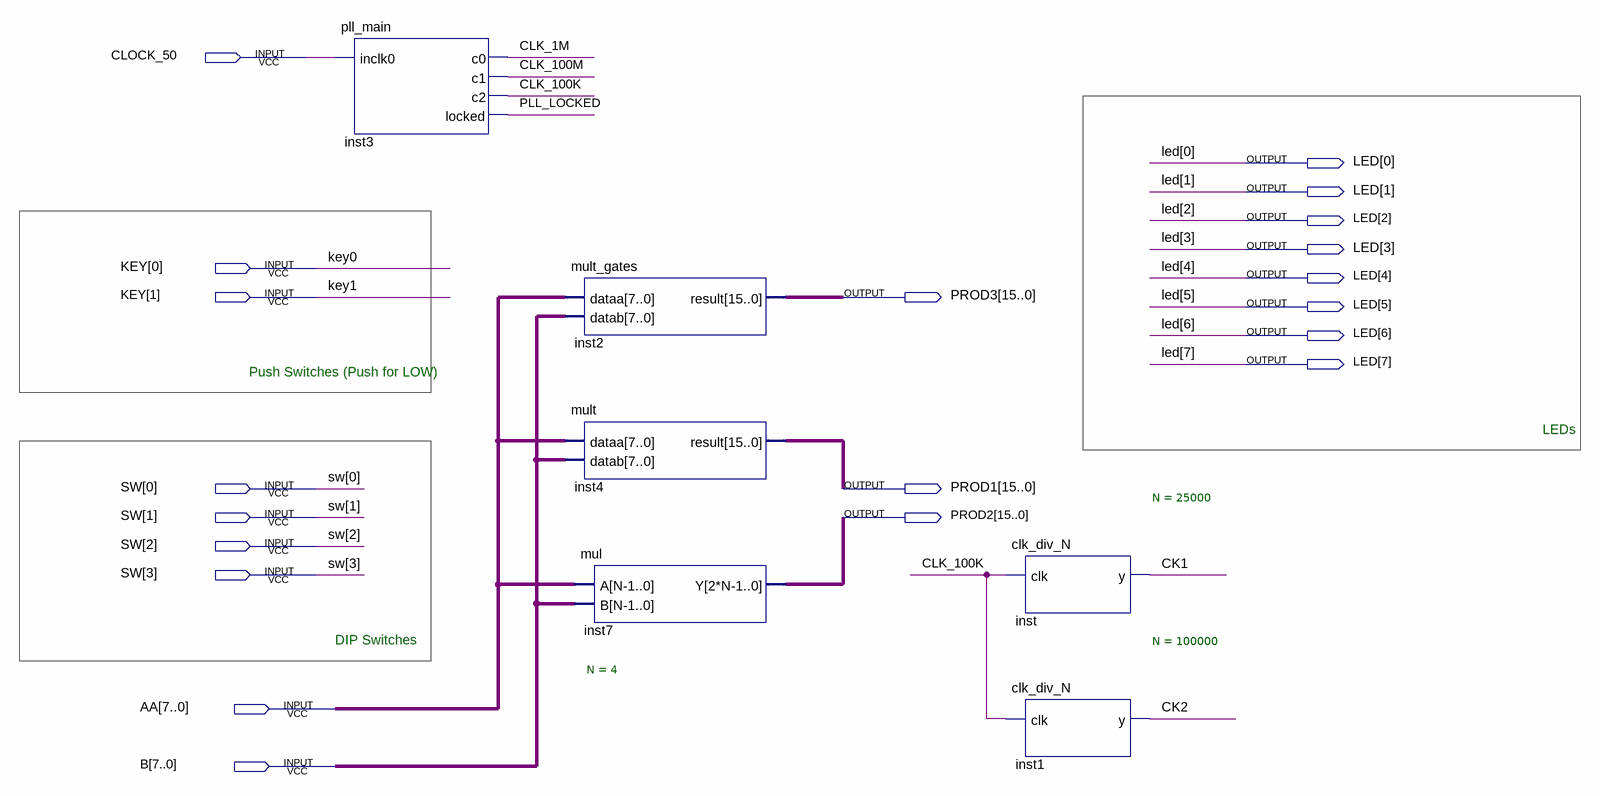
[diagram p0: schematic sheet]
// Quartus schematic TopLevelSchematic.bdf as structural Verilog: 6 symbols, 20 pins
module TopLevelSchematic (
  input  CLOCK_50,
  input  [1:0] KEY,
  input  [3:0] SW,
  input  [7:0] AA,
  input  [7:0] B,
  output [7:0] LED,
  output [15:0] PROD3,
  output [15:0] PROD1,
  output [15:0] PROD2
);

  wire CK1, CK2, CLK_1M, CLK_100K, CLK_100M, PLL_LOCKED;

  pll_main inst3 (.inclk0(CLOCK_50), .c0(CLK_1M), .c1(CLK_100M), .c2(CLK_100K), .locked(PLL_LOCKED));
  mult_gates inst2 (.dataa(AA), .datab(B), .result(PROD3));
  mult inst4 (.dataa(AA), .datab(B), .result(PROD1));
  mul #(.N(4)) inst7 (.A(AA), .B(B), .Y(PROD2));
  clk_div_N #(.N(25000)) inst (.clk(CLK_100K), .y(CK1));
  clk_div_N #(.N(100000)) inst1 (.clk(CLK_100K), .y(CK2));

  // Notes on the sheet:
  //   Push Switches (Push for LOW)
  //   LEDs
  //   DIP Switches
endmodule
